# Altium schematic sheet 引脚连接图监控端.SchDoc
size A4
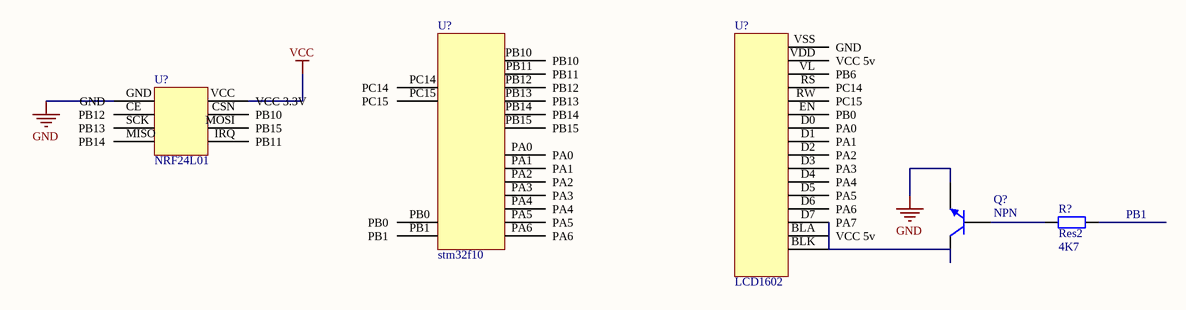
[diagram p0: 引脚连接图监控端.SchDoc]

## Parts
(Parts that share a designator on the sheet are numbered #1, #2 ... from top to bottom, then left to right.)
Q?  NPN  [TO-226-AA]
R?  Res2  value 4K7  [AXIAL-0.4]
U?#1  LCD1602
U?#2  stm32f10
U?#3  NRF24L01

## Nets
GND: Q?.3(E)
NetQ?_2: Q?.2(B) R?.1

Not connected (* = marked no-connect by the designer): Q? 1(C); R? 2; U?#1 BLA(VCC_5v) BLK D0(PA0) D1(PA1) D2(PA2) D3(PA3) D4(PA4) D5(PA5) D6(PA6) D7(PA7) EN(PB0) RS(PC14) RW(PC15) VDD(VCC_5v) VL(PB6) VSS(GND); U?#2 PA0 PA1 PA2 PA3 PA4 PA5 PA6 PB0 PB1 PB10 PB11 PB12 PB13 PB14 PB15 PC14 PC15; U?#3 CE(PB12) CSN(PB10) GND IRQ(PB11) MISO(PB14) MOSI(PB15) SCK(PB13) VCC(VCC_3.3V)

## Notes on the sheet
- (near R?) PB1

## Library data of the parts
Q? = NPN: NPN Bipolar Transistor; Published: 8-Jun-2000; LatestRevisionDate: 17-Jul-2002; LatestRevisionNote: Re-released for DXP Platform.; PackageReference: TO-226-AA; Publisher: Altium Limited; PackageDescription: TO, Flat Index; 3 In-Line, Axial Leads; Body Dia. 4.8mm; Leads 0.55 x 0.51 mm (max); Code_JEDEC: TO-226-AA
R? = Res2: Resistor; Published: 8-Jun-2000; LatestRevisionDate: 17-Jul-2002; LatestRevisionNote: Re-released for DXP Platform.; PackageReference: AXIAL-0.4; Publisher: Altium Limited; PackageDescription: Axial Device, Thru-Hole; 2 Leads; 0.4 in Pin Spacing